# Altium schematic sheet MPBoard_L1_PWR_ext.SchDoc
size A3; SheetNumber: 1; SheetTotal: 5; SPICEModelCacheOIQWJWRF: <root> / <DocumentId>OIQWJWRF</DocumentId> / </root>
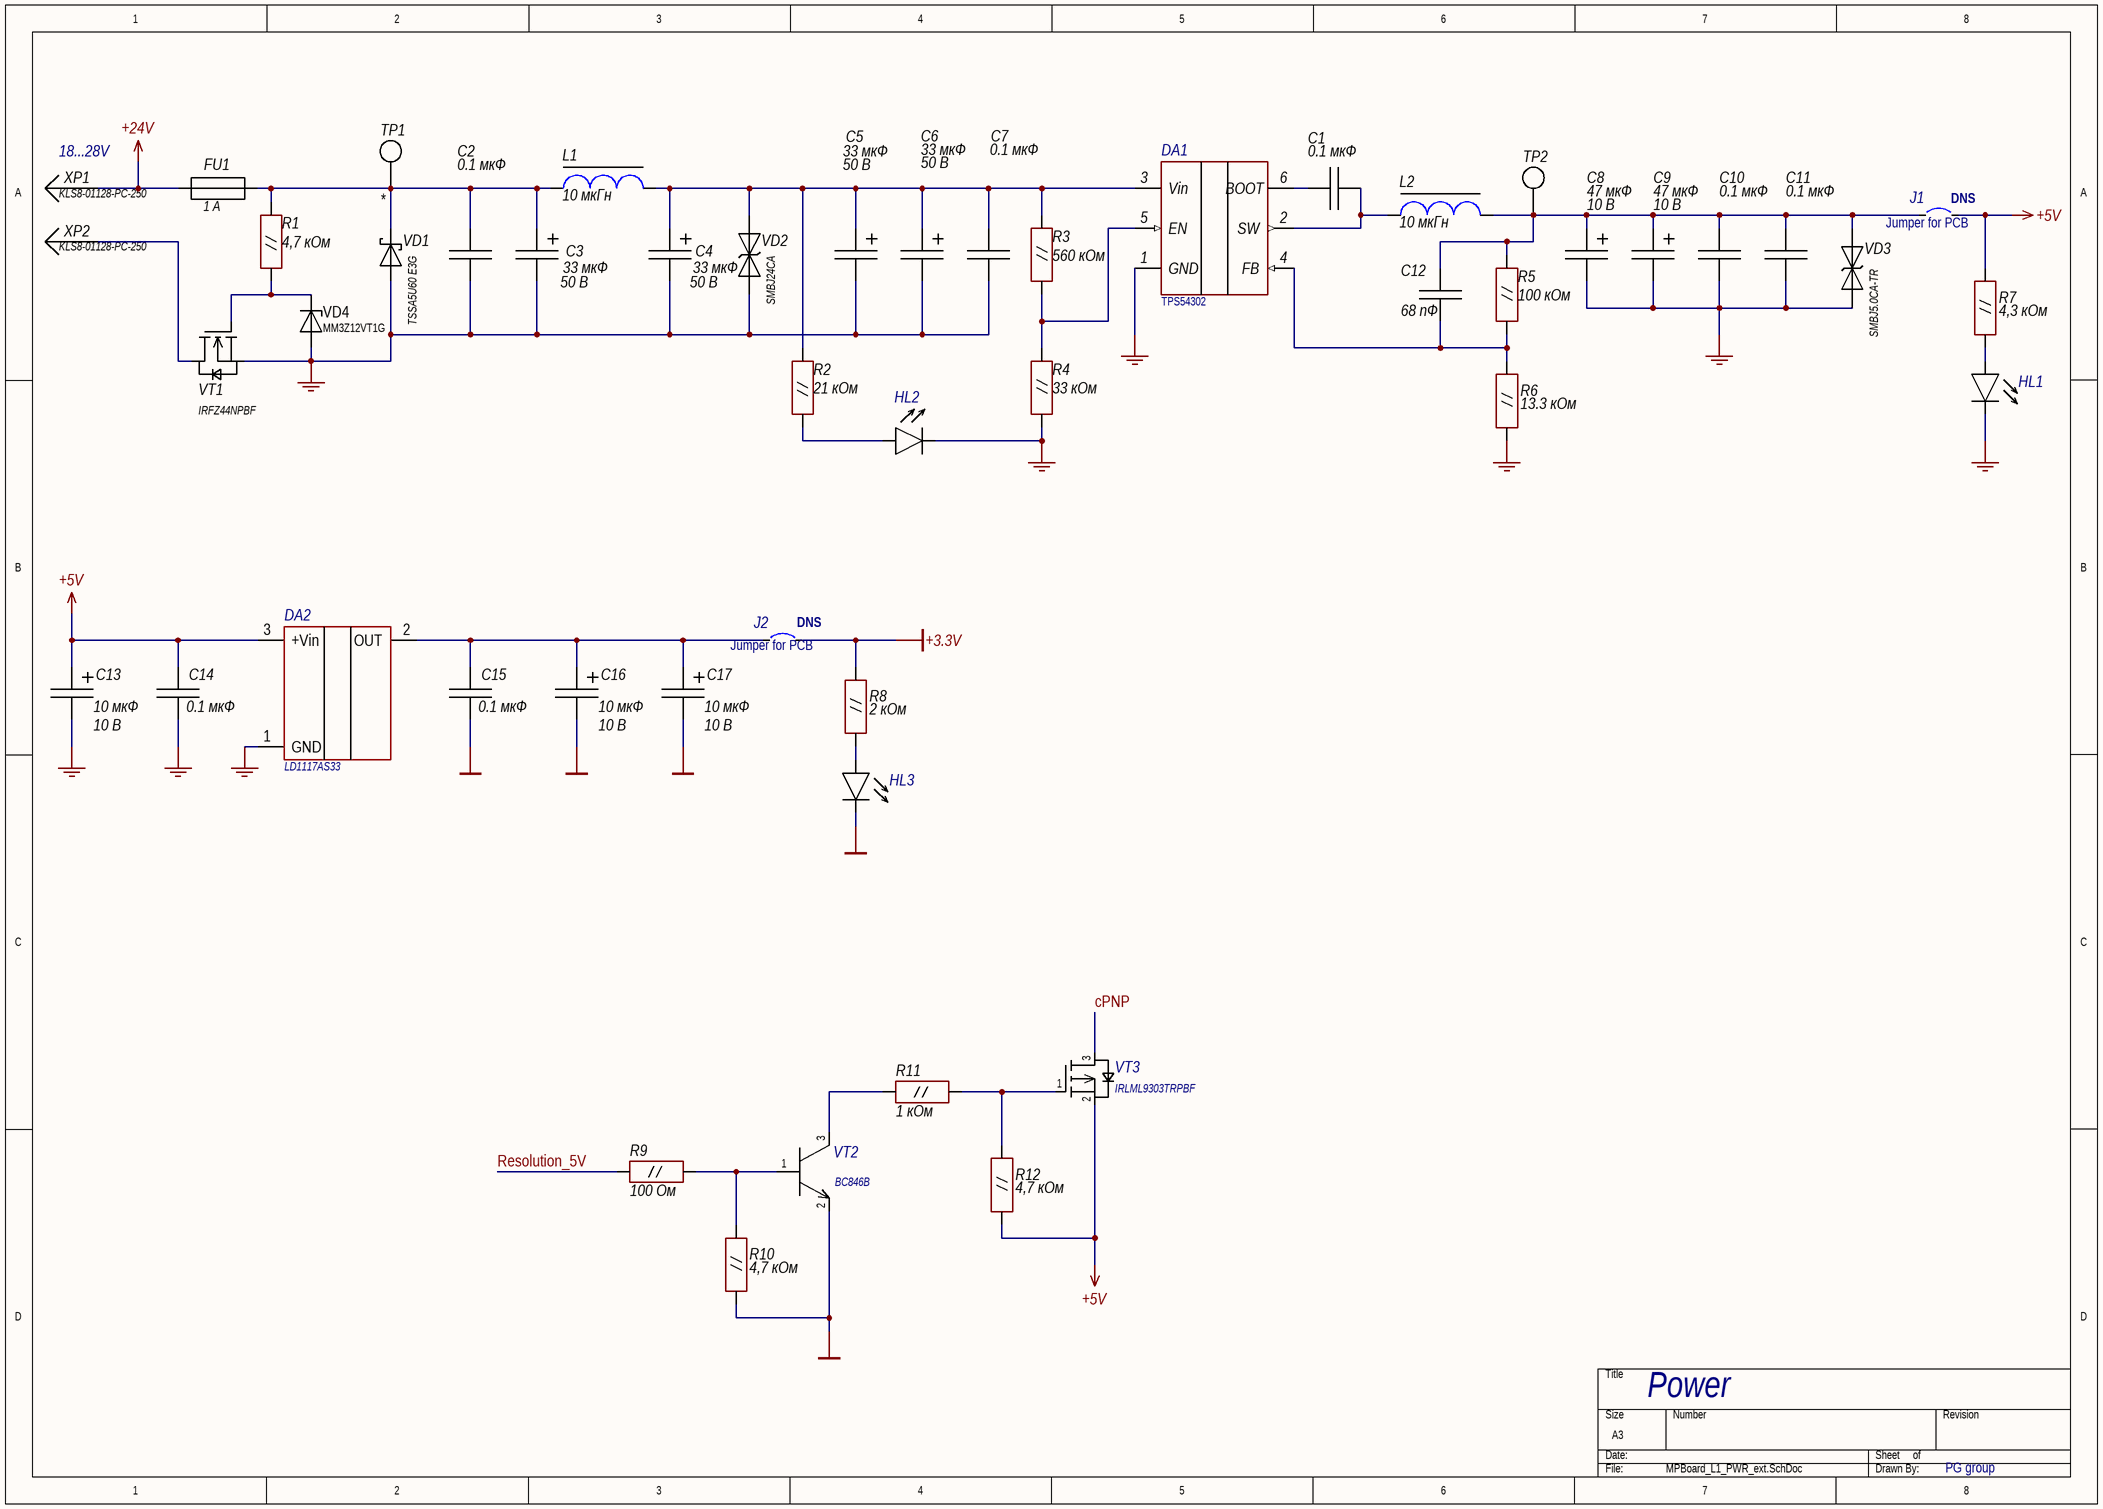
[diagram p0: MPBoard_L1_PWR_ext.SchDoc]

## Parts
C1  0.1 мкФ  [CAP-0805]
C2  0.1 мкФ  [CAP-0805]
C3  33 мкФ  Voltage: 50 В  [CAPAE-103]
C4  33 мкФ  Voltage: 50 В  [CAPAE-103]
C5  33 мкФ  Voltage: 50 В  [CAPAE-103]
C6  33 мкФ  Voltage: 50 В  [CAPAE-103]
C7  0.1 мкФ  [CAP-0805]
C8  47 мкФ  Voltage: 10 В  [CAPMP-3528]
C9  47 мкФ  Voltage: 10 В  [CAPMP-3528]
C10  0.1 мкФ  [CAP-0805]
C11  0.1 мкФ  [CAP-0805]
C12  68 пФ  [CAP-0805]
C13  10 мкФ  Voltage: 10 В  [CAPMP-3528]
C14  0.1 мкФ  [CAP-0805]
C15  0.1 мкФ  [CAP-0805]
C16  10 мкФ  Voltage: 10 В  [CAPMP-3528]
C17  10 мкФ  Voltage: 10 В  [CAPMP-3528]
DA1  TPS54302  [SOT23-6]
DA2  LD1117AS33  [SOT-223 LD1117]
FU1  1 A  [FUSE HOLDERS B 5X20]
HL1  Blue  [CH0805LB]  (value not drawn)
HL2  Red  [CH0805LR]  (value not drawn)
HL3  Green  [CH0805LG]  (value not drawn)
J1  Jumper for PCB  [JUMPER-SMD min]
J2  Jumper for PCB  [JUMPER-SMD min]
L1  10 мкГн  [IND_IHLP2525]
L2  10 мкГн  [IND_IHLP2525]
R1  4,7 кОм  [RES-0805]
R2  21 кОм  [RES-0805]
R3  560 кОм  [RES-0805]
R4  33 кОм  [RES-0805]
R5  100 кОм  [RES-0805]
R6  13.3 кОм  [RES-0805]
R7  4,3 кОм  [RES-0805]
R8  2 кОм  [RES-0805]
R9  100 Ом  [RES-0805]
R10  4,7 кОм  [RES-0805]
R11  1 кОм  [RES-0805]
R12  4,7 кОм  [RES-0805]
TP1  *  [TP_1.5]  (no BOM)
TP2  *  [TP_1.5]  (value not drawn)  (no BOM)
VD1  TSSA5U60 E3G  [DIODE SMA]
VD2  SMBJ24CA  [DIODE SMB]
VD3  SMBJ5.0CA-TR  [DIODE SMB]
VD4  MM3Z12VT1G  [SOD-323]
VT1  IRFZ44NPBF  [TO220S inline]
VT2  BC846B  [SOT23]
VT3  IRLML9303TRPBF  [SOT23]
XP1  KLS8-01128-PC-250  [PCB TAB 4]
XP2  KLS8-01128-PC-250  [PCB TAB 4]

## Nets
+3.3V: J2.2 R8.1
+5V: C13.1 C14.2 DA2.3(+Vin) J1.2 R7.1 R12.2 VT3.2(S)
+24V: FU1.1 XP1.1
GND: C2.2 C3.2 C4.2 C5.2 C6.2 C7.2 C8.2 C9.2 C10.2 C11.2 C13.2 C14.1 C15.1 C16.2 C17.2 DA1.1(GND) DA2.1(GND) HL1.2 HL2.2 HL3.2 R4.2 R6.2 R10.2 VD1.1 VD2.1 VD3.1 VD4.1 VT1.3(S) VT2.2(E)
cPNP: VT3.3(D)
Resolution_5V: R9.1
NetC1_1: C1.1 DA1.6(BOOT)
NetC1_2: C1.2 DA1.2(SW) L2.1
NetC2_1: C2.1 C3.1 FU1.2 L1.1 R1.2 TP1.1 VD1.2
NetC4_1: C4.1 C5.1 C6.1 C7.1 DA1.3(Vin) L1.2 R2.2 R3.1 VD2.2
NetC8_1: C8.1 C9.1 C10.1 C11.1 C12.1 J1.1 L2.2 R5.1 TP2.1 VD3.2
NetC12_2: C12.2 DA1.4(FB) R5.2 R6.1
NetC15_2: C15.2 C16.1 C17.1 DA2.2(OUT) J2.1
NetDA1_5: DA1.5(EN) R3.2 R4.1
NetHL1_1: HL1.1 R7.2
NetHL2_1: HL2.1 R2.1
NetHL3_1: HL3.1 R8.2
NetR1_1: R1.1 VD4.2 VT1.1(G)
NetR9_2: R9.2 R10.1 VT2.1(B)
NetR11_1: R11.1 VT2.3(C)
NetR11_2: R11.2 R12.1 VT3.1(G)
NetVT1_2: VT1.2(D) XP2.1

## Notes on the sheet
- (near XP1) 18...28V
- (near J1) DNS
- (near J2) DNS
- Power
- PG group

## Library data of the parts
C1 C2 C7 C10 = C: Конденсатор; MFPartNum: C0805C103K5RAC7025; IPSPartNumber: 65-724-19; Dielectric: X7R; MF: KEMET; Tolerance: ± 10 %; Voltage: 50 В; ValueDescription: Конденсатор 0.1 мкФ ± 10 % 50 В X7R SMD 0805; Package: SMD 0805; Value: 0.1 мкФ; HelpURL: https://content.kemet.com/datasheets/KEM_C1002_X7R_SMD.pdf; NameRUS: Конденсатор
C3 C4 = C_POLAR: Конденсатор полярный; MF: KEMET; Tolerance: ± 10 %; ValueDescription: Конденсатор 33 мкФ ± 10 % 50 В ECAP SMD; Package: ECAP SMD; Value: 33 мкФ; MFPartNum: *; HelpURL: *; IPSPartNumber: *; NameRUS: Конденсатор
C5 C6 = C_POLAR: Конденсатор полярный; IPSPartNumber: 2283588; MF: KEMET; Tolerance: ± 10 %; ValueDescription: Конденсатор 33 мкФ ± 10 % 50 В ECAP SMD; Package: ECAP SMD; Value: 33 мкФ; HelpURL: https://api.kemet.com/component-edge/download/datasheet/T491D336K035AT.pdf; NameRUS: Конденсатор
C8 C9 = C_POLAR: Конденсатор полярный / тантал; MFPartNum: T491B476K006AT; MF: KEMET; Tolerance: ± 10 %; ValueDescription: Конденсатор 47 мкФ ± 10 % 10 В Case B; Package: Case B; Value: 47 мкФ; HelpURL: https://content.kemet.com/datasheets/KEM_T2005_T491.pdf; IPSPartNumber: 300-47-868; NameRUS: Конденсатор
C11 = C: Конденсатор; MFPartNum: C0805C103K5RAC7025; IPSPartNumber: 65-765-65; Dielectric: X7R; MF: KEMET; Tolerance: ± 10 %; Voltage: 50 В; ValueDescription: Конденсатор 0.1 мкФ ± 10 % 50 В X7R SMD 0805; Package: SMD 0805; Value: 0.1 мкФ; HelpURL: https://content.kemet.com/datasheets/KEM_C1002_X7R_SMD.pdf; NameRUS: Конденсатор
C12 = C: Конденсатор; MFPartNum: C0805C680J5GACTU; Dielectric: C0G; MF: KEMET; Tolerance: ± 5 %; Voltage: 50 В; ValueDescription: Конденсатор 68 пФ ± 5 % 50 В C0G SMD 0805; Package: SMD 0805; Value: 68 пФ; IPSPartNumber: 165-72-398; NameRUS: Конденсатор
C13 C16 C17 = C_POLAR: Конденсатор полярный / тантал; MFPartNum: T491B476K006AT; MF: KEMET; Tolerance: ± 10 %; ValueDescription: Конденсатор 10 мкФ ± 10 % 10 В Case A; Package: Case A; Value: 10 мкФ; HelpURL: https://content.kemet.com/datasheets/KEM_T2005_T491.pdf; IPSPartNumber: 300-47-868; NameRUS: Конденсатор
C14 C15 = C: Конденсатор; MFPartNum: C0805C103K5RAC7025; MF: KEMET; Tolerance: ± 10 %; Voltage: 50 В; ValueDescription: Конденсатор 0.1 мкФ ± 10 % 50 В * SMD 0805; Dielectric: *; Package: SMD 0805; Value: 0.1 мкФ; HelpURL: *; IPSPartNumber: *; NameRUS: Конденсатор
DA1 = DA_TPS54302: DC/DC Buck; MFPartNum: TPS54302DDCR; MF: Texas Instruments; ValueDescription: Микросхема TPS54302 SOT23-6; NameRUS: Микросхема; Value: TPS54302; HelpURL: https://www.ti.com/lit/ds/symlink/tps54302.pdf?HQS=TI-null-null-digikeymode-df-pf-null-wwe&ts=1594294685289; Package: SOT23-6; IPSPartNumber: *
DA2 = DA_LD1117AS33: Linear Regulator 3.3V; MFPartNum: LD1117AS33TR; MF: STMicroelectronics; Package: SOT-223; HelpURL: https://eu.mouser.com/ProductDetail/STMicroelectronics/LD1117AS33TR?qs=C3bf%2FVrkE5CoDDd7wyn%252BaQ%3D%3D
FU1 = FU: Предохранитель; MFPartNum: RND 170-00190; Value: 1 A; MF: *; HelpURL: https://www.elfa.se/en/fuse-holder-clip-20-mm-3a-rnd-components-rnd-170-00190/p/30113404; IPSPartNumber: *; ValueDescription: =NameRUS+' '+Value+' '+ManufacturerPartNumber; NameRus: Предохранитель
HL1 = VD_LED: Светодиод; MFPartNum: FYLS-0805UBC; MF: Foryard; HelpURL: *; Value: Blue; Package: SMD 0805; IPSPartNumber: *; ValueDescription: =NameRUS+' '+ManufacturerPartNumber+' '+Package; NameRUS: Светодиод
HL2 = VD_LED: Светодиод; MFPartNum: FYLS-0805URC; MF: Foryard; HelpURL: *; Value: Red; Package: SMD 0805; IPSPartNumber: *; ValueDescription: =NameRUS+' '+ManufacturerPartNumber+' '+Package; NameRUS: Светодиод
HL3 = VD_LED: Светодиод; MFPartNum: FYLS-0805UGC; MF: Foryard; HelpURL: *; Value: Green; Package: SMD 0805; IPSPartNumber: *; ValueDescription: =NameRUS+' '+ManufacturerPartNumber+' '+Package; NameRUS: Светодиод
J1 J2 = Jumper: Перемычка на плату
L1 L2 = L_CORE: Индуктивность; MFPartNum: IHLP2525EZER100M01; MF: Vishay; AddDescription: 4.5А; Tolerance: ± 20 %; NameRUS: Дроссель; Value: 10 мкГн; HelpURL: https://www.vishay.com/docs/34177/ihlp-2525ez-01.pdf; IPSPartNumber: *; ValueDescription: =NameRUS+' '+Value+' '+Tolerance+' '+AddDescription+' '+Package
R1 R10 R12 = R_0.125W: Резистор 0.125 W; MFPartNum: CRCW080513K3FKEA; MF: Vishay; Tolerance: ± 1 %; ValueDescription: Резистор 4,7 кОм ± 1 % SMD 0805; Package: SMD 0805; Value: 4,7 кОм; HelpURL: https://www.vishay.com/docs/20035/dcrcwe3.pdf; IPSPartNumber: *; NameRUS: Резистор
R2 = R_0.125W: Резистор 0.125 W; MFPartNum: CRCW080513K3FKEA; MF: Vishay; Tolerance: ± 1 %; ValueDescription: Резистор 21 кОм ± 1 % SMD 0805; Package: SMD 0805; Value: 21 кОм; HelpURL: https://www.vishay.com/docs/20035/dcrcwe3.pdf; IPSPartNumber: *; NameRUS: Резистор
R3 = R_0.125W: Резистор 0.125 W; MFPartNum: CRCW080513K3FKEA; MF: Vishay; Tolerance: ± 5 %; ValueDescription: Резистор 560 кОм ± 5 % SMD 0805; Package: SMD 0805; Value: 560 кОм; HelpURL: https://www.vishay.com/docs/20035/dcrcwe3.pdf; IPSPartNumber: *; NameRUS: Резистор
R4 = R_0.125W: Резистор 0.125 W; MFPartNum: CRCW080513K3FKEA; MF: Vishay; Tolerance: ± 5 %; ValueDescription: Резистор 33 кОм ± 5 % SMD 0805; Package: SMD 0805; Value: 33 кОм; HelpURL: https://www.vishay.com/docs/20035/dcrcwe3.pdf; IPSPartNumber: *; NameRUS: Резистор
R5 = R_0.125W: Резистор 0.125 W; MFPartNum: CRCW080513K3FKEA; MF: Vishay; Tolerance: ± 5 %; ValueDescription: Резистор 100 кОм ± 5 % SMD 0805; Package: SMD 0805; Value: 100 кОм; HelpURL: https://www.vishay.com/docs/20035/dcrcwe3.pdf; IPSPartNumber: *; NameRUS: Резистор
R6 = R_0.125W: Резистор 0.125 W; MFPartNum: CRCW080513K3FKEA; MF: Vishay; Tolerance: ± 1 %; ValueDescription: Резистор 13.3 кОм ± 1 % SMD 0805; Package: SMD 0805; Value: 13.3 кОм; HelpURL: https://www.vishay.com/docs/20035/dcrcwe3.pdf; IPSPartNumber: *; NameRUS: Резистор
R7 = R_0.125W: Резистор 0.125 W; MFPartNum: CRCW080513K3FKEA; MF: Vishay; Tolerance: ± 1 %; ValueDescription: Резистор 4,3 кОм ± 1 % SMD 0805; Package: SMD 0805; Value: 4,3 кОм; HelpURL: https://www.vishay.com/docs/20035/dcrcwe3.pdf; IPSPartNumber: *; NameRUS: Резистор
R8 = R_0.125W: Резистор 0.125 W; MFPartNum: CRCW080513K3FKEA; MF: Vishay; Tolerance: ± 1 %; ValueDescription: Резистор 2 кОм ± 1 % SMD 0805; Package: SMD 0805; Value: 2 кОм; HelpURL: https://www.vishay.com/docs/20035/dcrcwe3.pdf; IPSPartNumber: *; NameRUS: Резистор
R9 = R_0.125W: Резистор 0.125 W; MFPartNum: CRCW080513K3FKEA; MF: Vishay; Tolerance: ± 1 %; ValueDescription: Резистор 100 Ом ± 1 % SMD 0805; Package: SMD 0805; Value: 100 Ом; HelpURL: https://www.vishay.com/docs/20035/dcrcwe3.pdf; IPSPartNumber: *; NameRUS: Резистор
R11 = R_0.125W: Резистор 0.125 W; MFPartNum: CRCW080513K3FKEA; MF: Vishay; Tolerance: ± 1 %; ValueDescription: Резистор 1 кОм ± 1 % SMD 0805; Package: SMD 0805; Value: 1 кОм; HelpURL: https://www.vishay.com/docs/20035/dcrcwe3.pdf; IPSPartNumber: *; NameRUS: Резистор
TP1 TP2 = TEST_POINT: Test Point; Name: *
VD1 = VD_SHOTTKY: Диод Шоттки; MF: Taiwan Semiconductor; Analogue: SS56; ValueDescription: Диод Шоттки TSSA5U60 E3G DO-214AC (SMA); MFPartNum: TSSA5U60 E3G; HelpURL: https://ru.mouser.com/datasheet/2/395/TSSA5U50%20SERIES_D1512-911402.pdf; Value: TSSA5U60 E3G; Package: DO-214AC (SMA); NameRUS: Диод Шоттки
VD2 = VD_TVS_BIDIR: Супрессор; MF: STMicroelectronics; ValueDescription: Супрессор SMBJ24CA DO-214AA (SMB); MFPartNum: SMBJ24CA; HelpURL: https://www.chipdip.by/product/smbj24ca-sunmate; Value: SMBJ24CA; Package: DO-214AA (SMB); IPSPartNumber: *; NameRUS: Супрессор
VD3 = VD_TVS_BIDIR: Супрессор; MF: STMicroelectronics; ValueDescription: Супрессор SMBJ5.0CA-TR DO-214AA (SMB); MFPartNum: SMBJ5.0CA-TR; HelpURL: https://www.chipdip.ru/product0/8001777571; Value: SMBJ5.0CA-TR; Package: DO-214AA (SMB); IPSPartNumber: 300-34-034; NameRUS: Супрессор
VD4 = VD_ZENER: Стабилитрон; MF: Nexperia; Analogue: BZX384-C12,115; ValueDescription: Стабилитрон MM3Z12VT1G SOD323; MFPartNum: MM3Z12VT1G; HelpURL: https://eu.mouser.com/datasheet/2/916/MM3Z_SER-2487701.pdf; Value: MM3Z12VT1G; Package: SOD323; NameRUS: Стабилитрон
VT1 = VT_N-MOSFET: MOSFET; MF: Infineon Technologies; NameRUS: N-канальный полевой транзистор; HelpURL: *; Value: IRFZ44N; IPSPartNumber: *; MFPartNum: IRFZ44NPBF; ValueDescription: =NameRUS+' '+ManufacturerPartNumber+' '+Voltage+' '+Current+' '+Package; Voltage: *; Current: *; Package: TO-220AB
VT2 = VT_NPN: NPN транзистор; MFPartNum: BC846B,215; MF: Nexperia B.V.; NameRUS: NPN биполярный транзистор; Voltage: 65 В; Current: 0.1; HelpURL: https://www.chipdip.by/product/bc846b; Value: BC846B; IPSPartNumber: *; ValueDescription: =NameRUS+' '+ManufacturerPartNumber+' '+Voltage+' '+Current+' '+Package; Package: SOT-23
VT3 = VT_P-MOSFET: P-MOSFET; MF: INFINEON TECHNOLOGIES AG.; Voltage: 30 В; Current: 2.3; MFPartNum: IRLML9303TRPBF; Package: SOT-23; HelpURL: https://www.chipdip.by/product/irlml9303trpbf
XP1 XP2 = XP1: Клемма папа; MF: KLS; MFPartNum: KLS8-01128-PC-250; HelpURL: https://www.chipdip.by/product/ta-m; Value: KLS8-01128-PC-250; Package: *